# Altium project LoRaBugBoard.PrjPcb
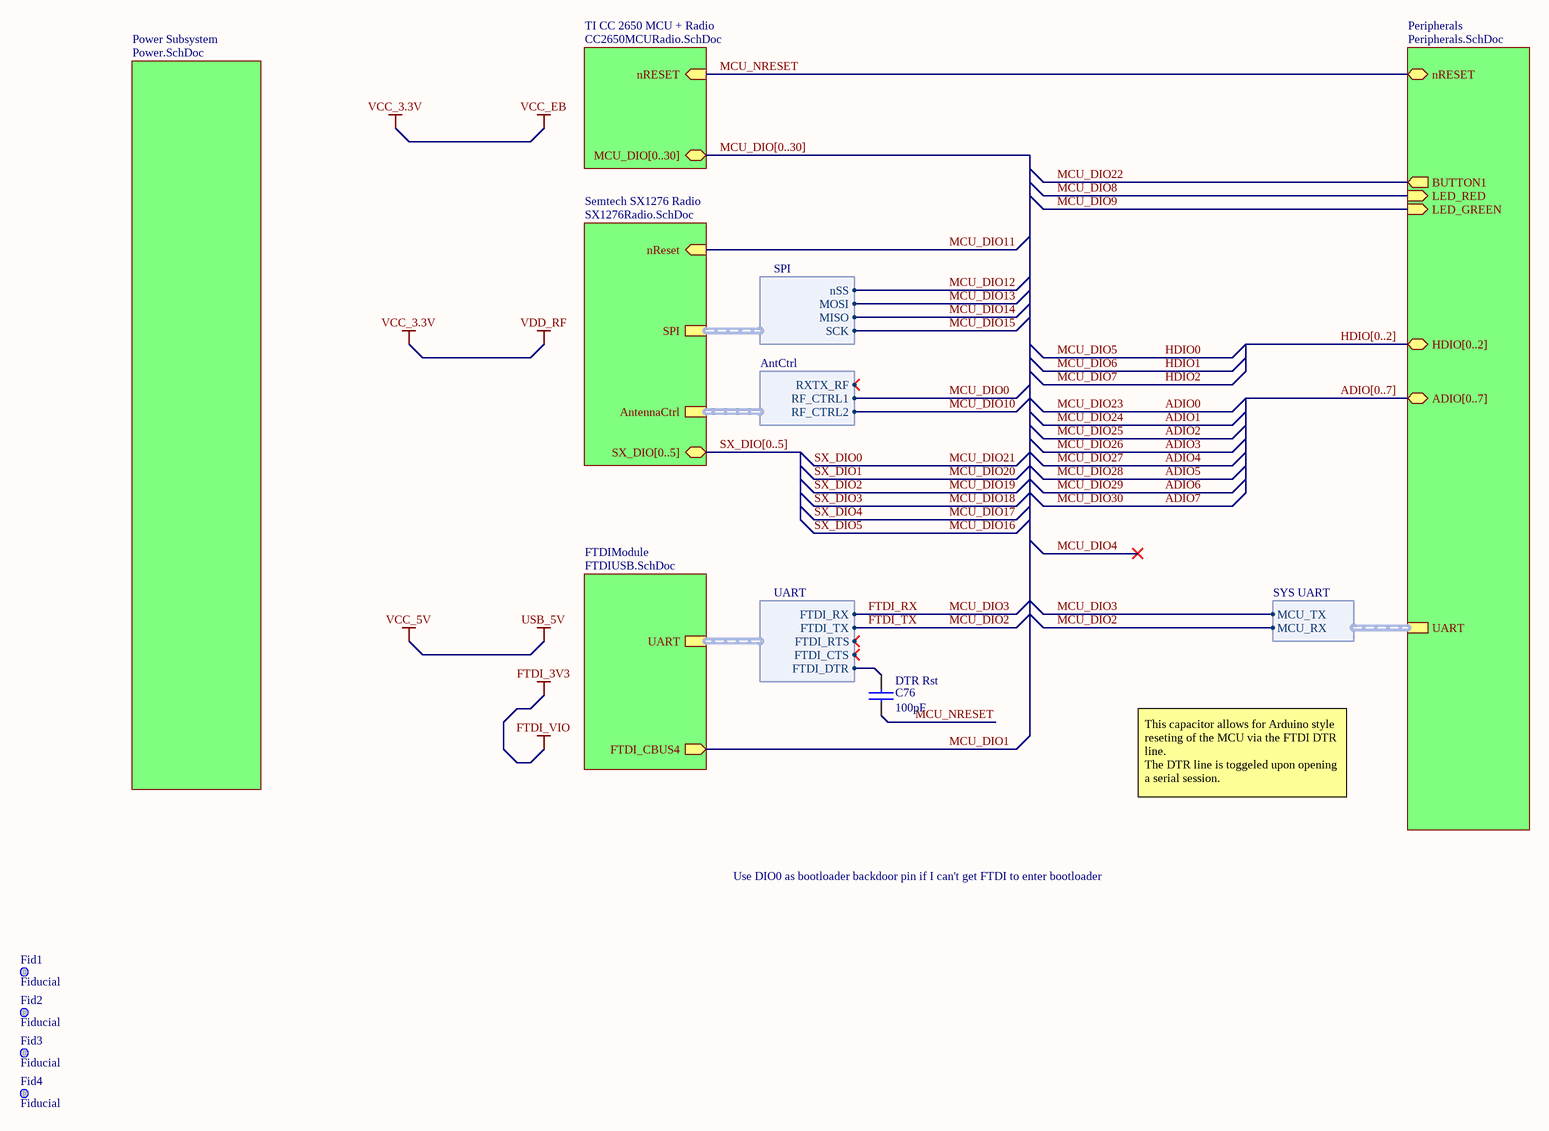
[diagram p0: Main.SchDoc]
6 sheets, 149 parts. Net scope: hierarchical (ports join the sheet entries above them; power ports are global).
Board files: PCBFireflyCase.PcbDoc, PCBFireflyCaseV2.PcbDoc, PCBFireflyCaseV3.PcbDoc, PCBFireflyCaseV3.1.PcbDoc, PCBFireflyCaseV4.PcbDoc
Sheets:
  Main.SchDoc
    Semtech SX1276 Radio = SX1276Radio.SchDoc
    TI CC 2650 MCU + Radio = CC2650MCURadio.SchDoc
    FTDIModule = FTDIUSB.SchDoc
    Peripherals = Peripherals.SchDoc
    Power Subsystem = Power.SchDoc

## Sheet Main.SchDoc: LoRaBug Main
size A3; Author: Craig Hesling; DrawnBy: Craig Hesling; Revision: 3

### Parts
C76  DTR Rst  value 100pF  [CAPC0402(1005)60_N]
Fid1  Fiducial  [Fiducial]
Fid2  Fiducial  [Fiducial]
Fid3  Fiducial  [Fiducial]
Fid4  Fiducial  [Fiducial]

### Sub-sheets
FTDIModule = FTDIUSB.SchDoc: UART (harness UART), FTDI_CBUS4 (out)
Peripherals = Peripherals.SchDoc: BUTTON1 (out), LED_RED (in), LED_GREEN (in), nRESET (bidir), ADIO[0..7] (bidir), HDIO[0..2] (bidir), UART (harness SYS UART)
Power Subsystem = Power.SchDoc: no entries
Semtech SX1276 Radio = SX1276Radio.SchDoc: SPI (harness SPI), nReset (in), AntennaCtrl (harness AntCtrl), SX_DIO[0..5] (bidir)
TI CC 2650 MCU + Radio = CC2650MCURadio.SchDoc: MCU_DIO[0..30] (bidir), nRESET (in)

### Harnesses
UART: FTDI_RX, FTDI_TX, FTDI_CTS, FTDI_RTS, FTDI_DTR
SPI: SCK, nSS, MOSI, MISO
AntCtrl: RF_CTRL1, RF_CTRL2, RXTX_RF
SYS UART: MCU_TX, MCU_RX

### Nets
FTDI_DTR: C76.2 ; sheet FTDIModule/UART.FTDI_DTR
FTDI_RX: sheet FTDIModule/UART.FTDI_RX, sheet Peripherals/UART.MCU_TX  [also labelled MCU_DIO3]  [project net DIO3]
FTDI_TX: sheet FTDIModule/UART.FTDI_TX, sheet Peripherals/UART.MCU_RX  [also labelled MCU_DIO2]  [project net DIO2]
MCU_NRESET: C76.1 ; sheet TI CC 2650 MCU + Radio/nRESET, sheet Peripherals/nRESET

### Buses and harness runs
bus ADIO[0..7] = sheet Peripherals/ADIO[0..7]
bus HDIO[0..2] = sheet Peripherals/HDIO[0..2]
bus MCU_DIO[0..30] = sheet TI CC 2650 MCU + Radio/MCU_DIO[0..30]
bus SX_DIO[0..5] = sheet Semtech SX1276 Radio/SX_DIO[0..5]

### Notes on the sheet
- This capacitor allows for Arduino style reseting of the MCU via the FTDI DTR line.
  The DTR line is toggeled upon opening a serial session.
- Use DIO0 as bootloader backdoor pin if I can't get FTDI to enter bootloader

### Library data of the parts
C76 = CAPACITOR
Fid1-Fid4 = Fiducial: Fiducial mark from Patrick's library

## Sheet SX1276Radio.SchDoc: Semtech SX1276 Radio
size A3; Author: Craig Hesling; DrawnBy: Craig Hesling; Revision: 3.1
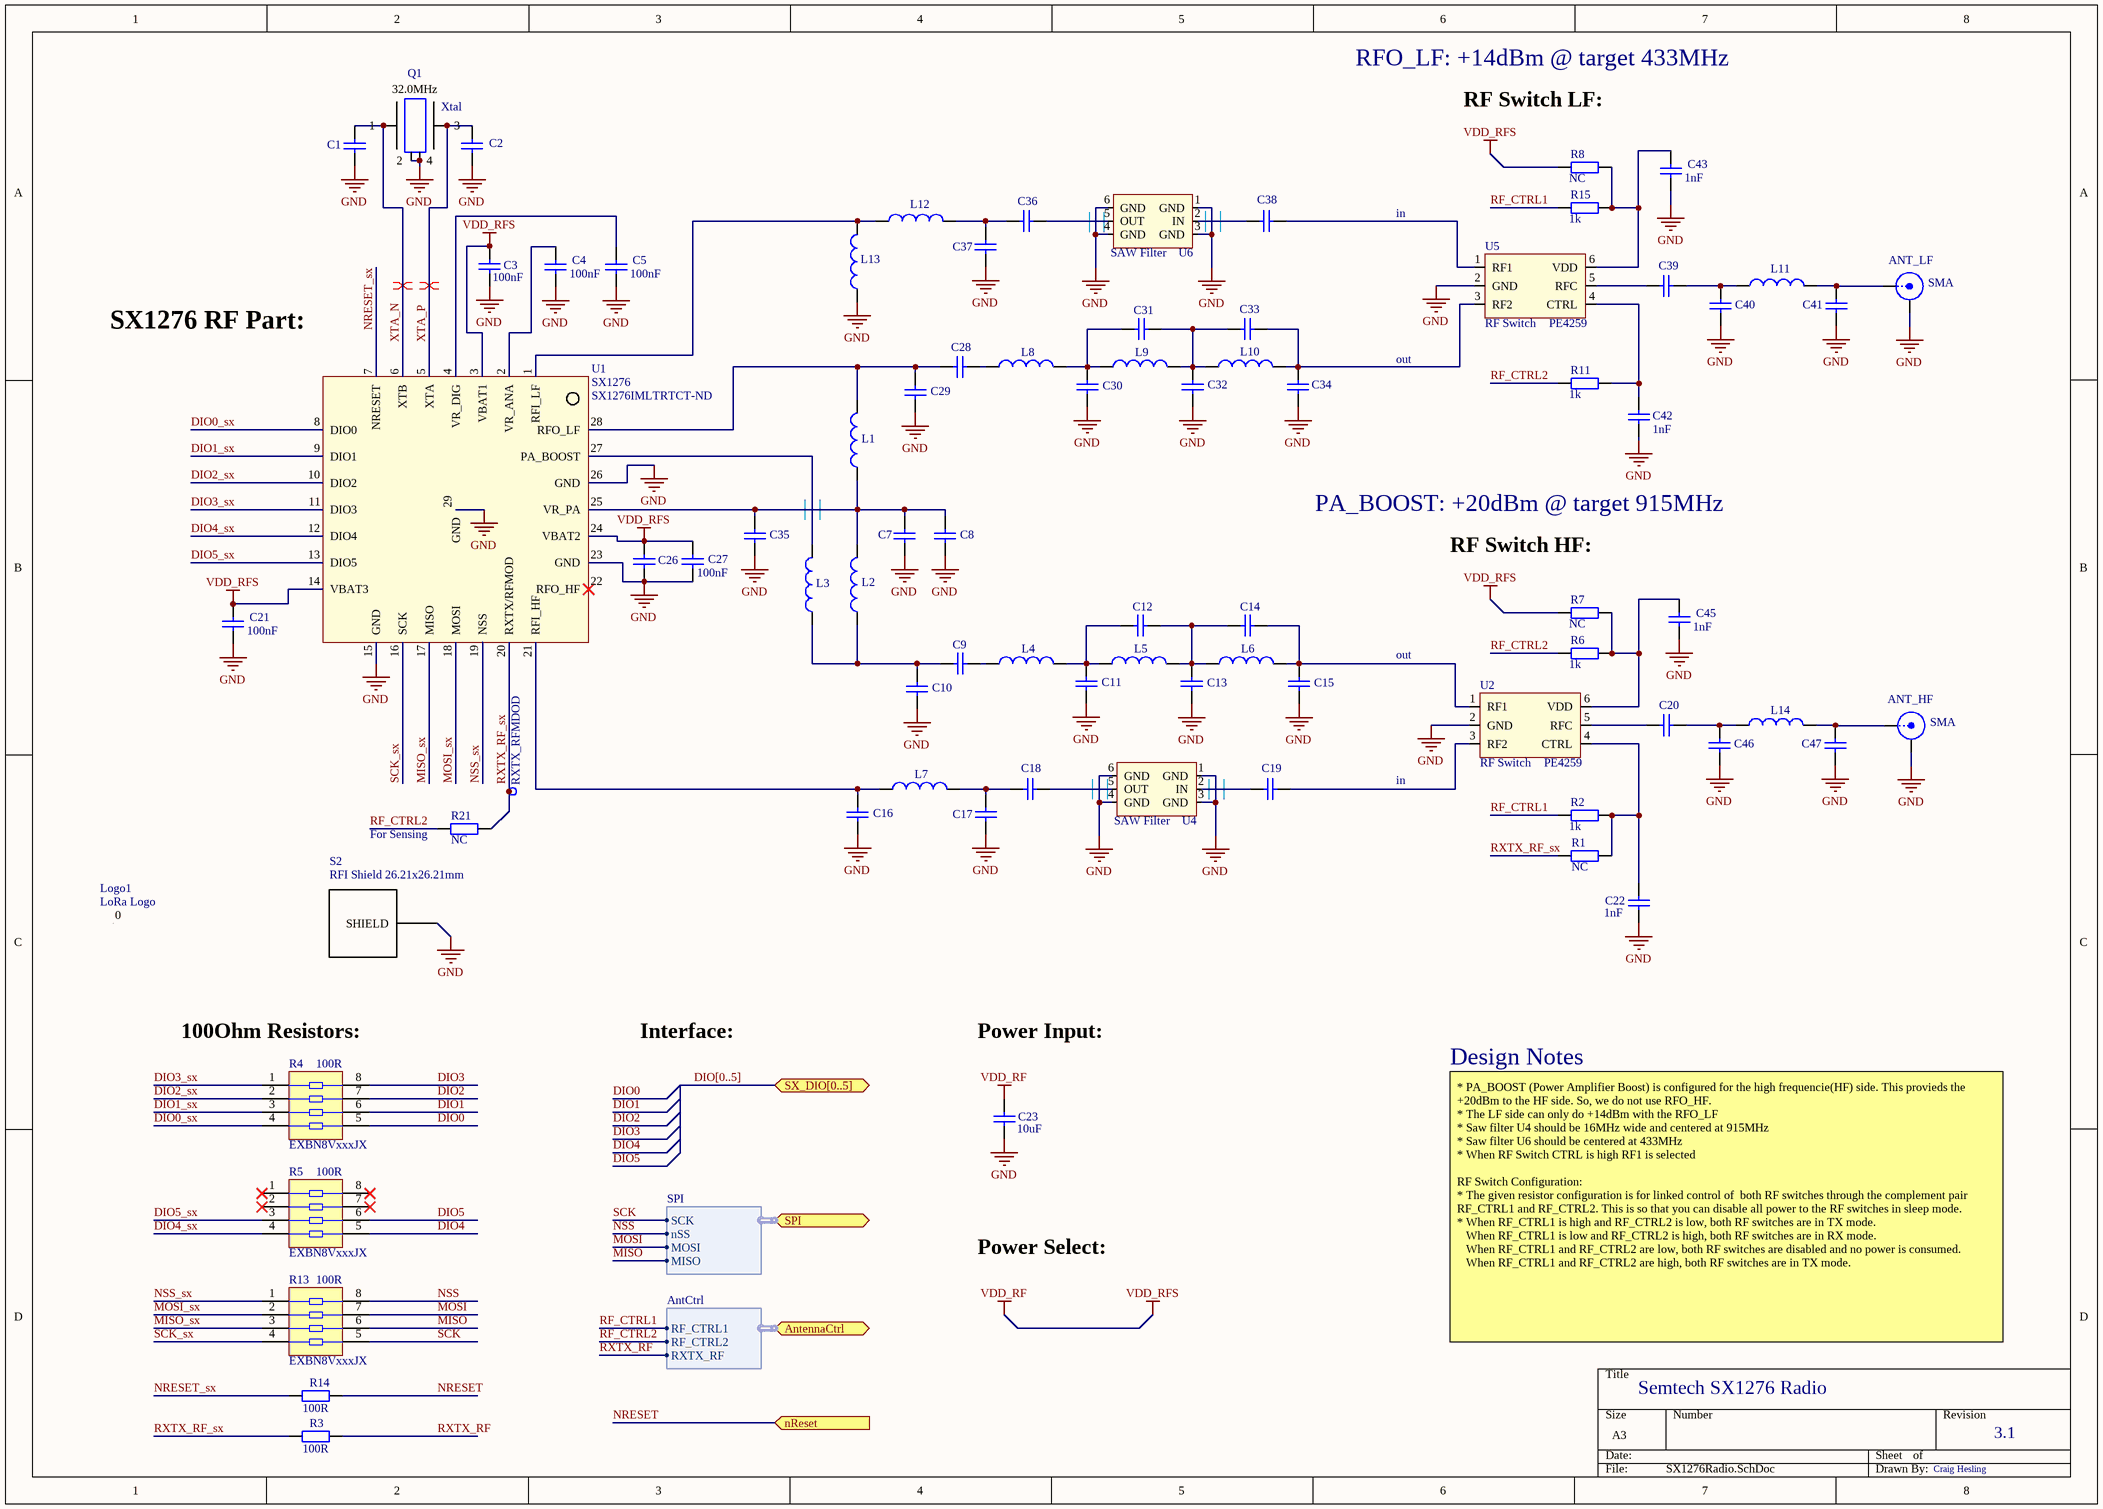
[diagram p1: SX1276Radio.SchDoc]

### Parts
ANT_HF  SMA  [SMA END LAUNCH JACK RECEPTACLE SHORT]
ANT_LF  SMA  [SMA END LAUNCH JACK RECEPTACLE SHORT]
C1  Cap  [rlc_402_smd]  (value not drawn)
C2  Cap  [rlc_402_smd]  (value not drawn)
C3  value 100nF  [rlc_402_smd]  (hidden comment: Cap)
C4  value 100nF  [rlc_402_smd]  (hidden comment: Cap)
C5  value 100nF  [rlc_402_smd]  (hidden comment: Cap)
C7  Cap  [rlc_402_smd]  (value not drawn)
C8  Cap  [rlc_402_smd]  (value not drawn)
C9  Cap  [rlc_402_smd]  (value not drawn)
C10  Cap  [rlc_402_smd]  (value not drawn)
C11  Cap  [rlc_402_smd]  (value not drawn)
C12  Cap  [rlc_402_smd]  (value not drawn)
C13  Cap  [rlc_402_smd]  (value not drawn)
C14  Cap  [rlc_402_smd]  (value not drawn)
C15  Cap  [rlc_402_smd]  (value not drawn)
C16  Cap  [rlc_402_smd]  (value not drawn)
C17  Cap  [rlc_402_smd]  (value not drawn)
C18  Cap  [rlc_402_smd]  (value not drawn)
C19  Cap  [rlc_402_smd]  (value not drawn)
C20  Cap  [rlc_402_smd]  (value not drawn)
C21  value 100nF  [rlc_402_smd]  (hidden comment: Cap)
C22  value 1nF  [rlc_402_smd]  (hidden comment: Cap)
C23  value 10uF  [rlc_805_smd]  (hidden comment: Cap)
C26  Cap  [rlc_402_smd]  (value not drawn)
C27  value 100nF  [rlc_402_smd]  (hidden comment: Cap)
C28  Cap  [rlc_402_smd]  (value not drawn)
C29  Cap  [rlc_402_smd]  (value not drawn)
C30  Cap  [rlc_402_smd]  (value not drawn)
C31  Cap  [rlc_402_smd]  (value not drawn)
C32  Cap  [rlc_402_smd]  (value not drawn)
C33  Cap  [rlc_402_smd]  (value not drawn)
C34  Cap  [rlc_402_smd]  (value not drawn)
C35  Cap  [rlc_402_smd]  (value not drawn)
C36  Cap  [rlc_402_smd]  (value not drawn)
C37  Cap  [rlc_402_smd]  (value not drawn)
C38  Cap  [rlc_402_smd]  (value not drawn)
C39  Cap  [rlc_402_smd]  (value not drawn)
C40  Cap  [rlc_402_smd]  (value not drawn)
C41  Cap  [rlc_402_smd]  (value not drawn)
C42  value 1nF  [rlc_402_smd]  (hidden comment: Cap)
C43  value 1nF  [rlc_402_smd]  (hidden comment: Cap)
C45  value 1nF  [rlc_402_smd]  (hidden comment: Cap)
C46  Cap  [rlc_402_smd]  (value not drawn)
C47  Cap  [rlc_402_smd]  (value not drawn)
L1  Inductor  [rlc_402_smd]  (value not drawn)
L2  Inductor  [rlc_402_smd]  (value not drawn)
L3  Inductor  [rlc_402_smd]  (value not drawn)
L4  Inductor  [rlc_402_smd]  (value not drawn)
L5  Inductor  [rlc_402_smd]  (value not drawn)
L6  Inductor  [rlc_402_smd]  (value not drawn)
L7  Inductor  [rlc_402_smd]  (value not drawn)
L8  Inductor  [rlc_402_smd]  (value not drawn)
L9  Inductor  [rlc_402_smd]  (value not drawn)
L10  Inductor  [rlc_402_smd]  (value not drawn)
L11  Inductor  [rlc_402_smd]  (value not drawn)
L12  Inductor  [rlc_402_smd]  (value not drawn)
L13  Inductor  [rlc_402_smd]  (value not drawn)
L14  Inductor  [rlc_402_smd]  (value not drawn)
Logo1  LoRa Logo  [Logo LoRa Size1]
Q1  Xtal  value 32.0MHz  [nd3225da - nd2520da]
R1  value NC  [rlc_402_smd]  (hidden comment: Resistor)
R2  value 1k  [rlc_402_smd]  (hidden comment: Resistor)
R3  value 100R  [rlc_402_smd]  (hidden comment: Resistor)
R4  EXBN8VxxxJX  value 100R  [EXB28V]
R5  EXBN8VxxxJX  value 100R  [EXB28V]
R6  value 1k  [rlc_402_smd]  (hidden comment: Resistor)
R7  value NC  [rlc_402_smd]  (hidden comment: Resistor)
R8  value NC  [rlc_402_smd]  (hidden comment: Resistor)
R11  value 1k  [rlc_402_smd]  (hidden comment: Resistor)
R13  EXBN8VxxxJX  value 100R  [EXB28V]
R14  value 100R  [rlc_402_smd]  (hidden comment: Resistor)
R15  value 1k  [rlc_402_smd]  (hidden comment: Resistor)
R21  value NC  [rlc_402_smd]  (hidden comment: Resistor)
RXTX_RFMDOD  Test Pin  [pin_SMD]  (value not drawn)
S2  RFI Shield 26.21x26.21mm  [RFI_SHIELD_26.21x26.21MM_Padded]
U1  SX1276  Supplier Part Number 1: SX1276IMLTRTCT-ND  [vqfn28_6x6mm_big_vias]
U2  RF Switch  value PE4259  [SC70-6]
U4  SAW Filter  [DCC6C_3.0x3.0mm]
U5  RF Switch  value PE4259  [SC70-6]
U6  SAW Filter  [DCC6C_3.0x3.0mm]

### Ports
AntennaCtrl (harness AntCtrl), nReset (in), SPI (harness SPI), SX_DIO[0..5] (bidir)

### Harnesses
SPI: SCK, nSS, MOSI, MISO
AntCtrl: RF_CTRL1, RF_CTRL2, RXTX_RF

### Nets
GND: ANT_HF.2(GND) ANT_LF.2(GND) C1.1 C2.1 C3.1 C4.1 C5.1 C7.1 C8.1 C10.1 C11.1 C13.1 C15.1 C16.1 C17.1 C21.1 C22.2 C23.1 C26.1 C27.1 C29.1 C30.1 C32.1 C34.1 C35.1 C37.1 C40.1 C41.1 C42.2 C43.1 C45.1 C46.1 C47.1 L13.1 Q1.2 Q1.4 S2.SHIELD U1.15(GND) U1.23(GND) U1.26(GND) U1.29(GND) U2.2(GND) U4.1(GND) U4.3(GND) U4.4(GND) U4.6(GND) U5.2(GND) U6.1(GND) U6.3(GND) U6.4(GND) U6.6(GND)
VDD_RF: C3.2 C21.2 C23.2 C26.2 C27.2 R7.2 R8.2 U1.3(VBAT1) U1.14(VBAT3) U1.24(VBAT2)  [also labelled VDD_RFS]  [project net VCC_3.3V]
DIO0: R4.5
DIO0_sx: R4.4 U1.8(DIO0)
DIO1: R4.6
DIO1_sx: R4.3 U1.9(DIO1)
DIO2: R4.7  [project net DIO19]
DIO2_sx: R4.2 U1.10(DIO2)
DIO3: R4.8  [project net DIO18]
DIO3_sx: R4.1 U1.11(DIO3)
DIO4: R5.5  [project net DIO17]
DIO4_sx: R5.4 U1.12(DIO4)
DIO5: R5.6  [project net DIO16]
DIO5_sx: R5.3 U1.13(DIO5)
MISO: R13.6 ; port SPI.MISO  [project net DIO14]
MISO_sx: R13.3 U1.17(MISO)
MOSI: R13.7 ; port SPI.MOSI  [project net DIO13]
MOSI_sx: R13.2 U1.18(MOSI)
NRESET: R14.2 ; port nReset  [project net DIO11]
NRESET_sx: R14.1 U1.7(NRESET)
NSS: R13.8 ; port SPI.nSS  [project net DIO12]
NSS_sx: R13.1 U1.19(NSS)
RF_CTRL1: R2.2 R15.2 ; port AntennaCtrl.RF_CTRL1  [project net DIO0]
RF_CTRL2: R6.2 R11.2 R21.2 ; port AntennaCtrl.RF_CTRL2  [project net DIO10]
RXTX_RF: R3.2 ; port AntennaCtrl.RXTX_RF
RXTX_RF_sx: R1.1 R3.1 R21.1 RXTX_RFMDOD.1(pin) U1.20(RXTX/RFMOD)
SCK: R13.5 ; port SPI.SCK  [project net DIO15]
SCK_sx: R13.4 U1.16(SCK)
XTA_N: C1.2 Q1.1 U1.6(XTB)
XTA_P: C2.2 Q1.3 U1.5(XTA)
NetANT_HF_1: ANT_HF.1(Signal) C47.2 L14.2
NetANT_LF_1: ANT_LF.1(Signal) C41.2 L11.2
NetC4_2: C4.2 U1.2(VR_ANA)
NetC5_2: C5.2 U1.4(VR_DIG)
NetC7_2: C7.2 C8.2 C35.2 L1.1 L2.2 U1.25(VR_PA)
NetC9_1: C9.1 L4.1
NetC9_2: C9.2 C10.2 L2.1 L3.1
NetC11_2: C11.2 C12.2 L4.2 L5.1
NetC12_1: C12.1 C13.2 C14.2 L5.2 L6.1
NetC14_1: C14.1 C15.2 L6.2 U2.1(RF1)
NetC16_2: C16.2 L7.1 U1.21(RFI_HF)
NetC17_2: C17.2 C18.2 L7.2
NetC18_1: C18.1 U4.5(OUT)
NetC19_1: C19.1 U2.3(RF2)
NetC19_2: C19.2 U4.2(IN)
NetC20_1: C20.1 C46.2 L14.1
NetC20_2: C20.2 U2.5(RFC)
NetC22_1: C22.1 R1.2 R2.1 U2.4(CTRL)
NetC28_1: C28.1 L8.1
NetC28_2: C28.2 C29.2 L1.2 U1.28(RFO_LF)
NetC30_2: C30.2 C31.2 L8.2 L9.1
NetC31_1: C31.1 C32.2 C33.2 L9.2 L10.1
NetC33_1: C33.1 C34.2 L10.2 U5.3(RF2)
NetC36_1: C36.1 U6.5(OUT)
NetC36_2: C36.2 C37.2 L12.2
NetC38_1: C38.1 U5.1(RF1)
NetC38_2: C38.2 U6.2(IN)
NetC39_1: C39.1 C40.2 L11.1
NetC39_2: C39.2 U5.5(RFC)
NetC42_1: C42.1 R11.1 U5.4(CTRL)
NetC43_2: C43.2 R8.1 R15.1 U5.6(VDD)
NetC45_2: C45.2 R6.1 R7.1 U2.6(VDD)
NetL3_2: L3.2 U1.27(PA_BOOST)
NetL12_1: L12.1 L13.2 U1.1(RFI_LF)

Not connected (* = marked no-connect by the designer): Logo1 0; R5 1* 2* 7* 8*; U1 22(RFO_HF)*

### Buses and harness runs
bus DIO[0..5] = port SX_DIO[0..5]

### Layout directives
differential pair: XTA_N, XTA_P

### Notes on the sheet
- RFO_LF: +14dBm @ target 433MHz
- RF Switch LF:
- in
- (near U1) SX1276 RF Part:
- out
- PA_BOOST: +20dBm @ target 915MHz
- RF Switch HF:
- (near R21) For Sensing
- (near R4) 100Ohm Resistors:
- Interface:
- Power Input:
- Design Notes
- Power Select:
- * PA_BOOST (Power Amplifier Boost) is configured for the high frequencie(HF) side. This provieds the +20dBm to the HF side. So, we do not use RFO_HF.
  * The LF side can only do +14dBm with the RFO_LF
  * Saw filter U4 should be 16MHz wide and centered at 915MHz
  * Saw filter U6 should be centered at 433MHz
  * When RF Switch CTRL is high RF1 is selected
  RF Switch Configuration:
  * The given resistor configuration is for linked control of  both RF switches through the complement pair RF_CTRL1 and RF_CTRL2. This is so that you can disable all power to the RF switches in sleep mode.
  * When RF_CTRL1 is high and RF_CTRL2 is low, both RF switches are in TX mode.
  When RF_CTRL1 is low and RF_CTRL2 is high, both RF switches are in RX mode.
  When RF_CTRL1 and RF_CTRL2 are low, both RF switches are disabled and no power is consumed.
  When RF_CTRL1 and RF_CTRL2 are high, both RF switches are in TX mode.

### Library data of the parts
ANT_HF ANT_LF = SMA: SMA Straight Connector; LatestRevisionDate: 05-oct-2007  -  Semtech; LatestRevisionNote: Re-released for DXP Platform.; Publisher: Altium Limited
C1 = Cap: Capacitor SMD; Value: 18pnF; Published: 8-Jun-2000; LatestRevisionDate: 05-oct-2007  -  Semtech; LatestRevisionNote: Re-released for DXP Platform.; Publisher: Altium Limited
C2 = Cap: Capacitor SMD; Value: 18pF; Published: 8-Jun-2000; LatestRevisionDate: 05-oct-2007  -  Semtech; LatestRevisionNote: Re-released for DXP Platform.; Publisher: Altium Limited
C3-C5 C21-C23 C27 C42 C43 C45 = Cap: Capacitor SMD; Published: 8-Jun-2000; LatestRevisionDate: 05-oct-2007  -  Semtech; LatestRevisionNote: Re-released for DXP Platform.; Publisher: Altium Limited
C7-C20 C28-C33 C35-C39 = Cap: Capacitor SMD; Value: 100nF; Published: 8-Jun-2000; LatestRevisionDate: 05-oct-2007  -  Semtech; LatestRevisionNote: Re-released for DXP Platform.; Publisher: Altium Limited
C26 = Cap: Capacitor SMD; Value: 100pF; Published: 8-Jun-2000; LatestRevisionDate: 05-oct-2007  -  Semtech; LatestRevisionNote: Re-released for DXP Platform.; Publisher: Altium Limited
C34 C40 C41 C46 C47 = Cap: Capacitor SMD; Value: NC; Published: 8-Jun-2000; LatestRevisionDate: 05-oct-2007  -  Semtech; LatestRevisionNote: Re-released for DXP Platform.; Publisher: Altium Limited
L1-L9 L12 L13 = Inductor: Inductor SMD; Code_IEC: 1005; Value: VAL?; Published: 8-Jun-2000; LatestRevisionDate: 05-oct-2007  -  Semtech; LatestRevisionNote: Re-released for DXP Platform.; Publisher: Altium Limited; Code_JEITA: 0402
L10 L11 L14 = Inductor: Inductor SMD; Code_IEC: 1005; Value: 0R; Published: 8-Jun-2000; LatestRevisionDate: 05-oct-2007  -  Semtech; LatestRevisionNote: Re-released for DXP Platform.; Publisher: Altium Limited; Code_JEITA: 0402
Logo1 = Logo: Schematic symbol for Logo
Q1 = Xtal GND: Crystal with GND pins; LatestRevisionDate: 05-oct-2007  -  Semtech
R1-R3 R6-R8 R11 R14 R15 R21 = Resistor: Resistor SMD - IEC symbol version; LatestRevisionDate: 27-Jul-20  -  Semtech
R4 R5 R13 = EXBN8VxxxJX: Mini-Flat Package, Isolated Resistor Network, 0.031 W/resistor; Supplier 1: Digi-Key; Supplier Part Number 1: Y10101TR-ND
RXTX_RFMDOD = test_pin: LatestRevisionDate: 05-oct-2007  -  Semtech
S2 = RFI_SHIELD_26.21x26.21mm: Supplier 1: Digi-Key; Supplier Part Number 1: 903-1008-1-ND
U1 = SX1276: SX1276 - Low Power Integrated UHF Transceiver with loRa Modem; LatestRevisionDate: 27-Jul-2009 -  Semtech; Supplier 1: Digi-Key
U2 U5 = PE4259 RF Switch: PE4259 Peregrine RF Switch; LatestRevisionDate: 03-Sep-2012 -  Semtech
U4 U6 = SAW Filter: SAW Filter - Bandpass - TEMEX type; LatestRevisionDate: 05-oct-2007  -  Semtech

## Sheet CC2650MCURadio.SchDoc: TI CC2650 Radio and MCU
size A3; Author: Craig Hesling; DrawnBy: Craig Hesling; Revision: 2
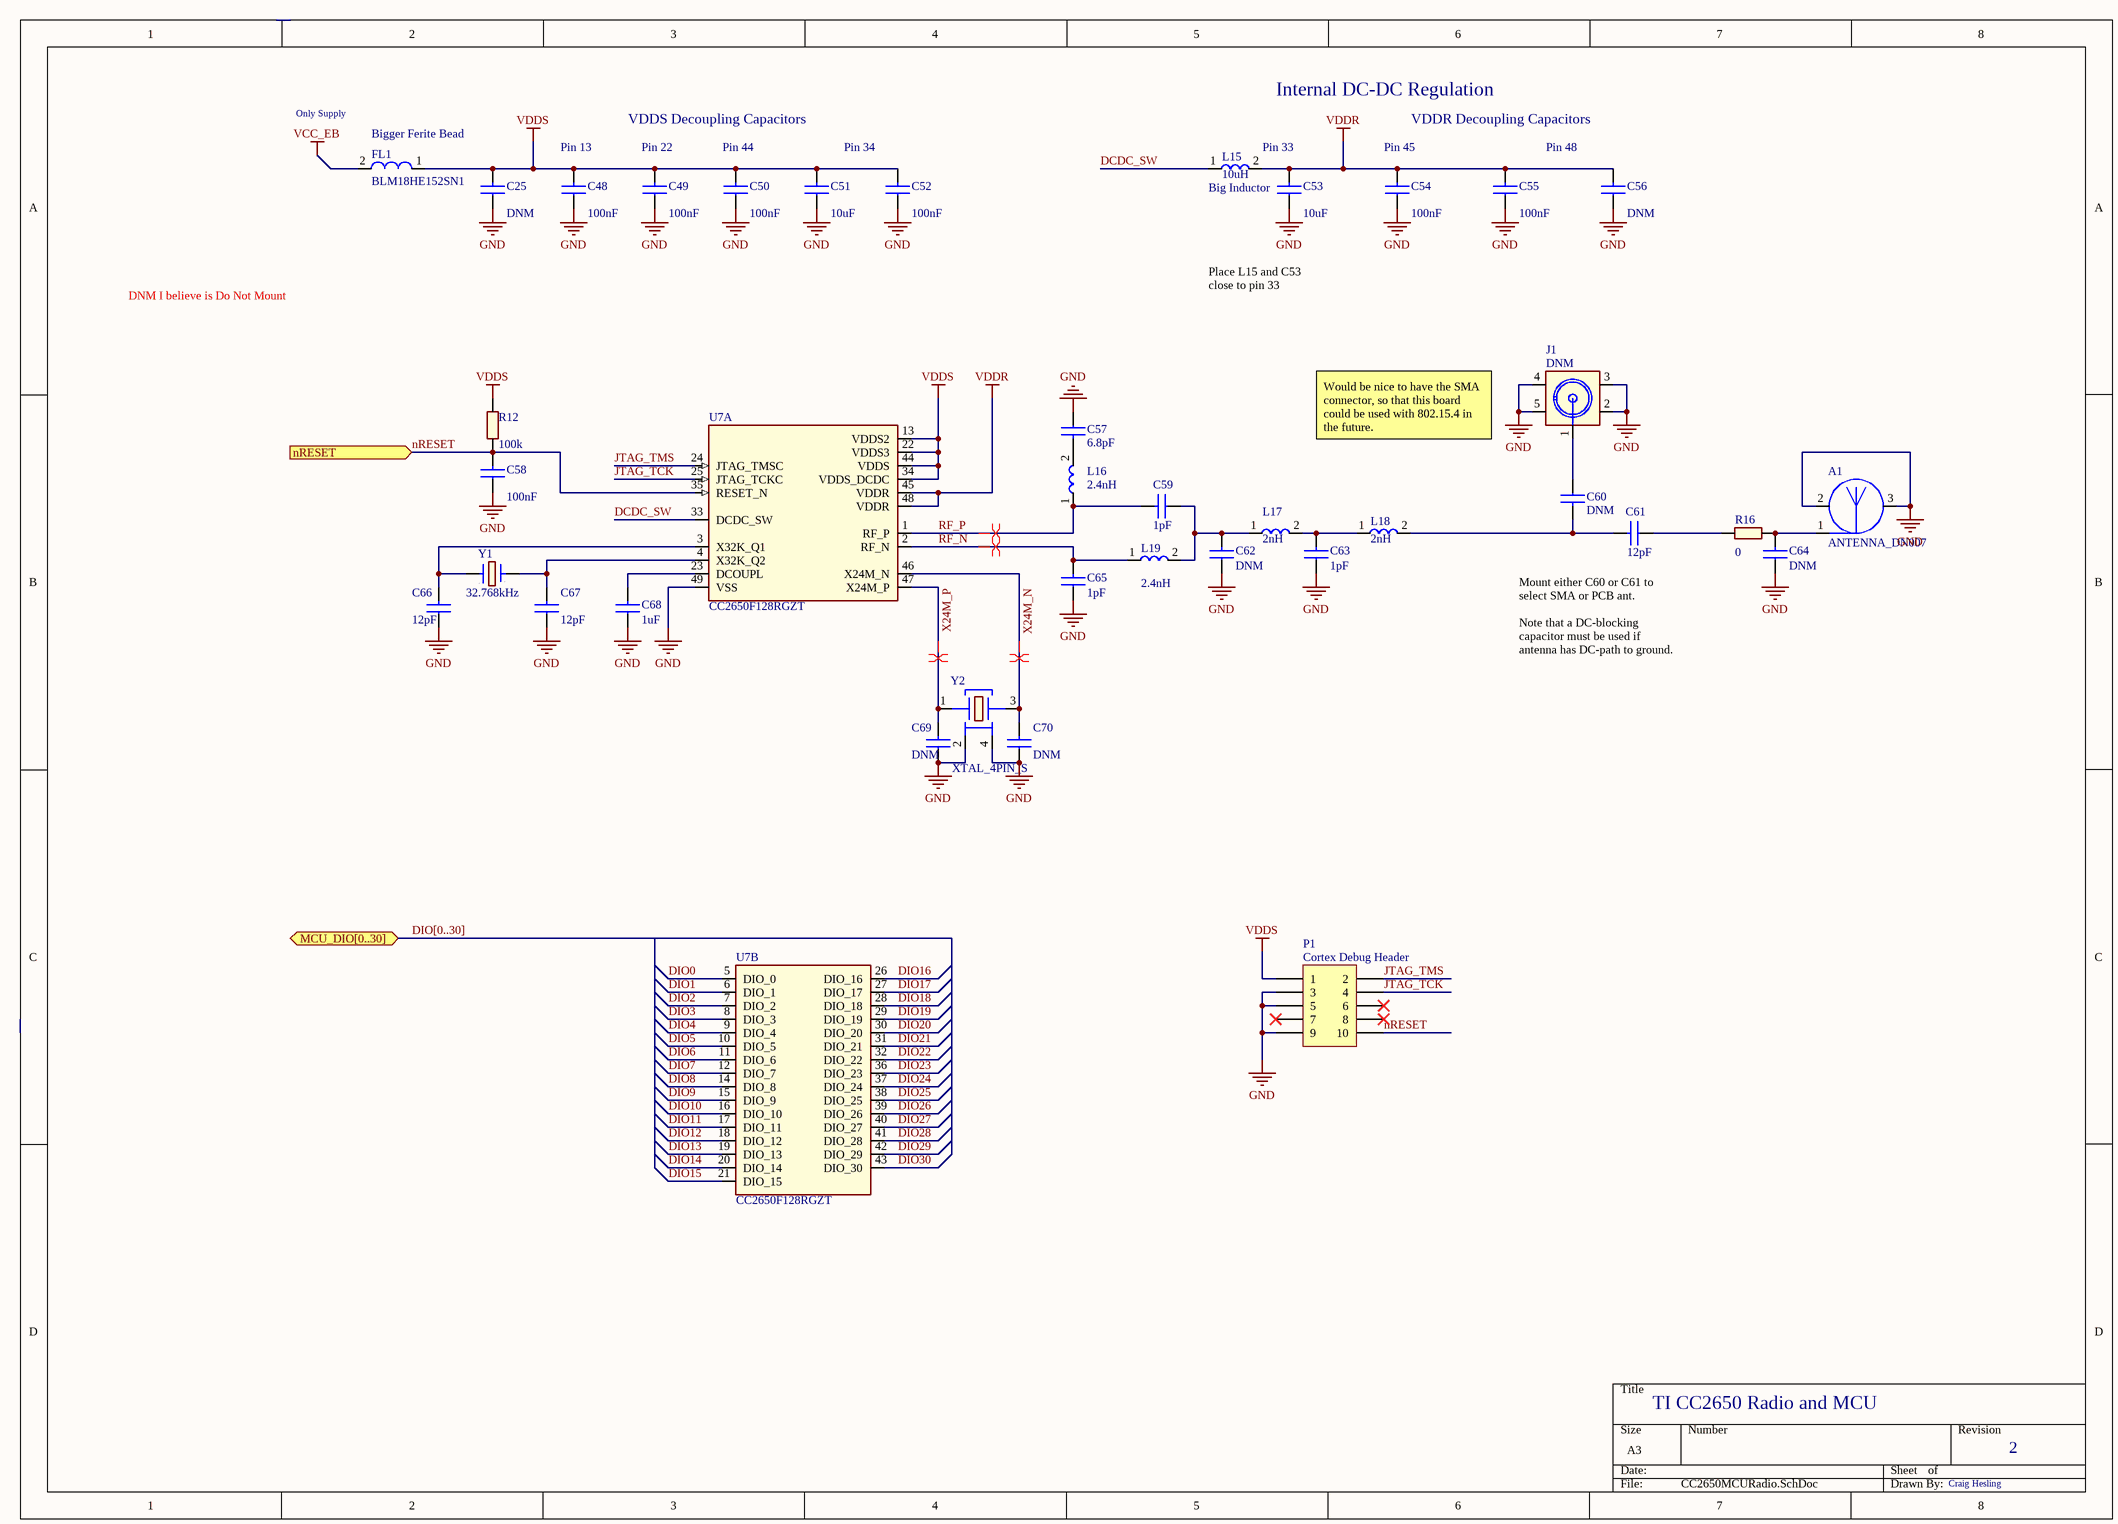
[diagram p2: CC2650MCURadio.SchDoc]

### Parts
A1  ANTENNA_DN007  [ANTENNA_DN007AN_NO_MASK]
C25  value DNM  [CAPC0402(1005)60_N]  (hidden comment: CAPACITOR)
C48  value 100nF  [CAPC0402(1005)60_N]  (hidden comment: CAPACITOR)
C49  value 100nF  [CAPC0402(1005)60_N]  (hidden comment: CAPACITOR)
C50  value 100nF  [CAPC0402(1005)60_N]  (hidden comment: CAPACITOR)
C51  value 10uF  [CAPC0603(1608)100_N]  (hidden comment: CAPACITOR)
C52  value 100nF  [CAPC0603(1608)100_N]  (hidden comment: CAPACITOR)
C53  value 10uF  [CAPC0603(1608)100_N]  (hidden comment: CAPACITOR)
C54  value 100nF  [CAPC0402(1005)60_N]  (hidden comment: CAPACITOR)
C55  value 100nF  [CAPC0402(1005)60_N]  (hidden comment: CAPACITOR)
C56  value DNM  [CAPC0402(1005)60_N]  (hidden comment: CAPACITOR)
C57  value 6.8pF  [CAPC0402(1005)60_N]  (hidden comment: CAPACITOR)
C58  value 100nF  [CAPC0402(1005)60_N]  (hidden comment: CAPACITOR)
C59  value 1pF  [CAPC0402(1005)60_N]  (hidden comment: CAPACITOR)
C60  value DNM  [CAPC0402(1005)60_N]  (hidden comment: CAPACITOR)
C61  value 12pF  [CAPC0402(1005)60_N]  (hidden comment: CAPACITOR)
C62  value DNM  [CAPC0402(1005)60_N]  (hidden comment: CAPACITOR)
C63  value 1pF  [CAPC0402(1005)60_N]  (hidden comment: CAPACITOR)
C64  value DNM  [CAPC0402(1005)60_N]  (hidden comment: CAPACITOR)
C65  value 1pF  [CAPC0402(1005)60_N]  (hidden comment: CAPACITOR)
C66  value 12pF  [CAPC0402(1005)60_N]  (hidden comment: CAPACITOR)
C67  value 12pF  [CAPC0402(1005)60_N]  (hidden comment: CAPACITOR)
C68  value 1uF  [CAPC0402(1005)60_N]  (hidden comment: CAPACITOR)
C69  value DNM  [CAPC0402(1005)60_N]  (hidden comment: CAPACITOR)
C70  value DNM  [CAPC0402(1005)60_N]  (hidden comment: CAPACITOR)
FL1  BLM18HE152SN1  [FIL_BLM18HE152SN1DL]
J1  DNM  [HUSTSAN_SMA10V21TGGAN_POLYGONPOUR_CUTOUT]
L15  value 10uH  [CAPC0805(2012)75_N]  (hidden comment: INDUCTOR)
L16  value 2.4nH  [INDC1005X60L]  (hidden comment: INDUCTOR)
L17  value 2nH  [INDC1005X60L]  (hidden comment: INDUCTOR)
L18  value 2nH  [INDC1005X60L]  (hidden comment: INDUCTOR)
L19  value 2.4nH  [INDC1005X60L]  (hidden comment: INDUCTOR)
P1  Cortex Debug Header  [Header 1.27mm 2x5 SMD]
R12  value 100k  [RESC1005X40L]  (hidden comment: RESISTOR)
R16  value 0  [RESC1005X40L]  (hidden comment: RESISTOR)
U7  CC2650F128RGZT  [QFN50P700X700X100_HS-49N]  (parts A,B of 2)
Y1  Frequency: 32.768kHz  [XTAL_FC-135N]  (hidden comment: CRYSTAL)
Y2  XTAL_4PIN_S  [Crystal 4-SMD 5.0x3.2mm]

### Ports
MCU_DIO[0..30] (bidir), nRESET (in)

### Nets
GND: A1.2(GND_2) A1.3(GND_3) C25.1 C48.1 C49.1 C50.1 C51.1 C52.1 C53.1 C54.1 C55.1 C56.1 C57.1 C58.1 C62.1 C63.1 C64.1 C65.1 C66.1 C67.1 C68.1 C69.1 C70.1 J1.2 J1.3 J1.4 J1.5 P1.3 P1.5 P1.9 U7.49(VSS) Y2.2 Y2.4
VCC_EB: FL1.2  [project net VCC_3.3V]
VDDR: C53.2 C54.2 C55.2 C56.2 L15.2 U7.45(VDDR) U7.48(VDDR)
VDDS: C25.2 C48.2 C49.2 C50.2 C51.2 C52.2 FL1.1 P1.1 R12.2 U7.13(VDDS2) U7.22(VDDS3) U7.34(VDDS_DCDC) U7.44(VDDS)
DCDC_SW: L15.1 U7.33(DCDC_SW)
DIO0: U7.5(DIO_0)
DIO1: U7.6(DIO_1)
DIO2: U7.7(DIO_2)
DIO3: U7.8(DIO_3)
DIO4: U7.9(DIO_4)
DIO5: U7.10(DIO_5)
DIO6: U7.11(DIO_6)
DIO7: U7.12(DIO_7)
DIO8: U7.14(DIO_8)
DIO9: U7.15(DIO_9)
DIO10: U7.16(DIO_10)
DIO11: U7.17(DIO_11)
DIO12: U7.18(DIO_12)
DIO13: U7.19(DIO_13)
DIO14: U7.20(DIO_14)
DIO15: U7.21(DIO_15)
DIO16: U7.26(DIO_16)
DIO17: U7.27(DIO_17)
DIO18: U7.28(DIO_18)
DIO19: U7.29(DIO_19)
DIO20: U7.30(DIO_20)  [project net DIO1]
DIO21: U7.31(DIO_21)  [project net DIO0]
DIO22: U7.32(DIO_22)
DIO23: U7.36(DIO_23)  [project net ADIO0]
DIO24: U7.37(DIO_24)  [project net ADIO1]
DIO25: U7.38(DIO_25)  [project net ADIO2]
DIO26: U7.39(DIO_26)  [project net ADIO3]
DIO27: U7.40(DIO_27)  [project net ADIO4]
DIO28: U7.41(DIO_28)  [project net ADIO5]
DIO29: U7.42(DIO_29)  [project net ADIO6]
DIO30: U7.43(DIO_30)  [project net ADIO7]
JTAG_TCK: P1.4 U7.25(JTAG_TCKC)
JTAG_TMS: P1.2 U7.24(JTAG_TMSC)
nRESET: C58.2 P1.10 R12.1 U7.35(RESET_N) ; port nRESET  [project net MCU_NRESET]
RF_N: C65.2 L19.1 U7.2(RF_N)
RF_P: C59.2 L16.1 U7.1(RF_P)
X24M_N: C70.2 U7.46(X24M_N) Y2.3
X24M_P: C69.2 U7.47(X24M_P) Y2.1
NetA1_1: A1.1(FEED_1) C64.2 R16.1
NetC57_2: C57.2 L16.2
NetC59_1: C59.1 C62.2 L17.1 L19.2
NetC60_1: C60.1 J1.1
NetC60_2: C60.2 C61.2 L18.2
NetC61_1: C61.1 R16.2
NetC63_2: C63.2 L17.2 L18.1
NetC66_2: C66.2 U7.3(X32K_Q1) Y1.1
NetC67_2: C67.2 U7.4(X32K_Q2) Y1.2
NetC68_2: C68.2 U7.23(DCOUPL)

Not connected (* = marked no-connect by the designer): P1 6* 7* 8*

### Buses and harness runs
bus DIO[0..30] = port MCU_DIO[0..30]

### Layout directives
differential pair: RF_N, RF_P, X24M_N, X24M_P

### Notes on the sheet
- (near FL1) Only Supply
- VDDS Decoupling Capacitors
- Internal DC-DC Regulation
- VDDR Decoupling Capacitors
- Bigger Ferite Bead
- (near C48) Pin 13
- (near C49) Pin 22
- (near C50) Pin 44
- Pin 34
- Big Inductor
- Pin 33
- (near C54) Pin 45
- Pin 48
- DNM I believe is Do Not Mount
- Place L15 and C53 close to pin 33
- Would be nice to have the SMA connector, so that this board could be used with 802.15.4 in the future.
- (near C61) Mount either C60 or C61 to select SMA or PCB ant.
  Note that a DC-blocking capacitor must be used if antenna has DC-path to ground.

### Library data of the parts
A1 = ANTENNA_DN007: Designed by: Artur Bielinski; Design date: 2011-09-19
C25 C48-C70 = CAPACITOR: TC2: 0; MAX_TEMP: CTMAX; SLOPE: CSMAX; DIST: FLAT; PSpiceTemplate: C^@REFDES %1 %2 ?TOLERANCE|C^@REFDES| @VALUE ?IC/IC=@IC/ TC=@TC1,@TC2 ?TOLERANCE|\n.model C^@REFDES CAP C=1 DEV=@TOLERANCE%|; KNEE: CBMAX; CURRENT: CIMAX; VOLTAGE: CMAX; TC1: 0
FL1 = FILTER_2PIN
J1 = CONN_COAX_1+4
L15-L19 = INDUCTOR: DIST: FLAT; DIELECTRIC: DSMAX; PSpiceTemplate: L^@REFDES %1 %2 ?TOLERANCE|L^@REFDES| @VALUE ?IC/IC=@IC/ ?TOLERANCE|\n.model l^@REFDES IND L=1 DEV=@TOLERANCE%|; Current: LMAX
P1 = Header 5X2: Header, 5-Pin, Dual row, Right Angle; LatestRevisionDate: 17-Jul-2002; LatestRevisionNote: Re-released for DXP Platform.; Publisher: Altium Limited; Supplier 1: Digi-Key; Supplier 2: Newark; Supplier 3: Allied; Supplier 4: Mouser; Supplier 5: Arrow; Supplier Part Number 1: 609-3695-1-ND; Supplier Part Number 2: 58R3188; Supplier Part Number 3: 70247660; Supplier Part Number 4: 649-202112100010C4LF; Supplier Part Number 5: XRQSqUttyxup-fqyNuPGZKBQalM97QjttTt_8zN-BzU
R12 = RESISTOR: PSpiceTemplate: R^@REFDES %1 %2 ?TOLERANCE|R^@REFDES| @VALUE TC=@TC1,@TC2 ?TOLERANCE|\n.model R^@REFDES RES R=1 DEV=@TOLERANCE%|; VOLTAGE: RVMAX; DIST: FLAT; MAX_TEMP: RTMAX; TC1: 0; POWER: RMAX; TC2: 0
R16 = RESISTOR: PSpiceTemplate: R^@REFDES %1 %2 ?TOLERANCE|R^@REFDES| @VALUE TC=@TC1,@TC2 ?TOLERANCE|\n.model R^@REFDES RES R=1 DEV=@TOLERANCE%|; VOLTAGE: RVMAX; DIST: FLAT; MAX_TEMP: RTMAX; POWER: RMAX; TC1: 0; TC2: 0
U7 = CC2650F128RGZT: Designed_By: Artur Bielinski; SPLIT_INST: TRUE; SWAP_INFO: (S1+S2); Design_Date: 2013-02-14; PartNumber: CC2650F128RGZT; Supplier 1: Mouser; Supplier 2: Newark; Supplier 3: Arrow; Supplier 4: Digi-Key; Supplier Part Number 1: 595-CC2650F128RGZR; Supplier Part Number 2: 51Y5273; Supplier Part Number 3: tP0-S_ikkGau3GntdWAPvj-z4JJMLRcy006RExL3IaQ; Supplier Part Number 4: 296-39656-1-ND

## Sheet FTDIUSB.SchDoc: FTDI USB
size A; Author: Craig Hesling; DrawnBy: Craig Hesling; Revision: 3
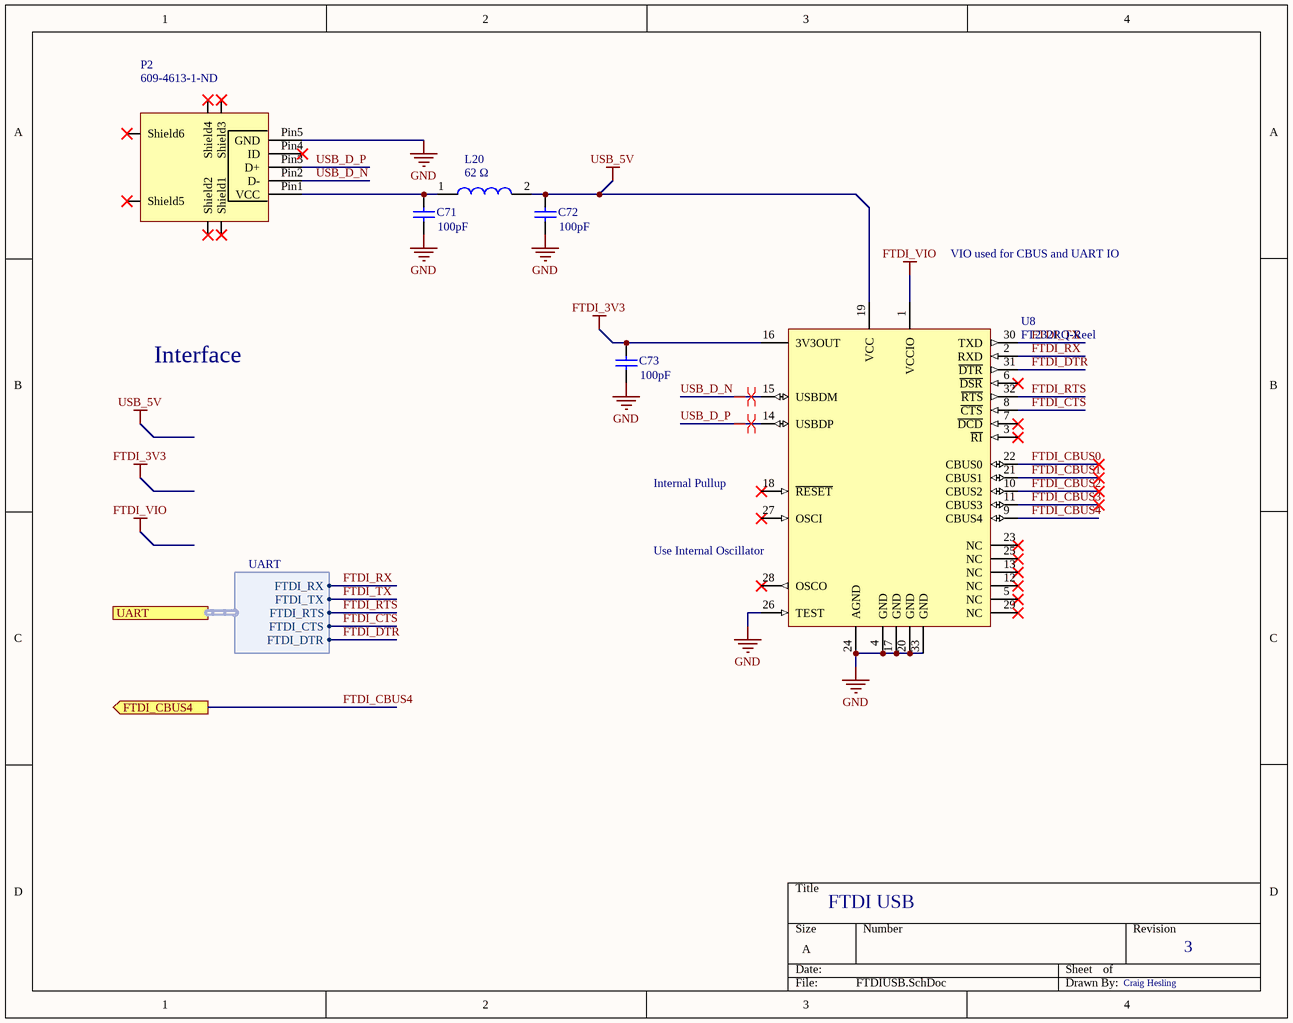
[diagram p3: FTDIUSB.SchDoc]

### Parts
C71  value 100pF  [CAPC0603(1608)100_N]  (hidden comment: Cap Semi)
C72  value 100pF  [CAPC0603(1608)100_N]  (hidden comment: Cap Semi)
C73  value 100pF  [CAPC0603(1608)100_N]  (hidden comment: Cap Semi)
L20  62 Ω  [WE-CBA_0603_HC]
P2  Supplier Part Number 1: 609-4613-1-ND  [MicroUSB_TypeB]  (hidden comment: Micro USB Type-B)
U8  FT232RQ-Reel  [PQFN5X5-32_V_FTDI_BIG_VIAS]

### Ports
FTDI_CBUS4 (out), UART (harness UART)

### Harnesses
UART: FTDI_RX, FTDI_TX, FTDI_DTR, FTDI_CTS, FTDI_RTS

### Nets
FTDI_3V3: C73.2 U8.1(VCCIO) U8.16(3V3OUT)  [also labelled FTDI_VIO]
GND: C71.1 C72.1 C73.1 P2.Pin5(GND) U8.4(GND) U8.17(GND) U8.20(GND) U8.24(AGND) U8.26(TEST) U8.33(GND)
USB_5V: C72.2 L20.2 U8.19(VCC)
FTDI_CBUS0: U8.22(CBUS0)
FTDI_CBUS1: U8.21(CBUS1)
FTDI_CBUS2: U8.10(CBUS2)
FTDI_CBUS3: U8.11(CBUS3)
FTDI_CBUS4: U8.9(CBUS4) ; port FTDI_CBUS4  [project net DIO1]
FTDI_CTS: U8.8(~{CTS}) ; port UART.FTDI_CTS
FTDI_DTR: U8.31(~{DTR}) ; port UART.FTDI_DTR
FTDI_RTS: U8.32(~{RTS}) ; port UART.FTDI_RTS
FTDI_RX: U8.2(RXD) ; port UART.FTDI_RX  [project net DIO3]
FTDI_TX: U8.30(TXD) ; port UART.FTDI_TX  [project net DIO2]
USB_D_N: P2.Pin2(D-) U8.15(USBDM)
USB_D_P: P2.Pin3(D+) U8.14(USBDP)
NetC71_2: C71.2 L20.1 P2.Pin1(VCC)

Not connected (* = marked no-connect by the designer): P2 Pin4(ID)* Shield1* Shield2* Shield3* Shield4* Shield5* Shield6*; U8 3(~{RI})* 5(NC)* 6(~{DSR})* 7(~{DCD})* 12(NC)* 13(NC)* 18(~{RESET})* 23(NC)* 25(NC)* 27(OSCI)* 28(OSCO)* 29(NC)*

### Layout directives
differential pair: USB_D_N, USB_D_P

### Notes on the sheet
- VIO used for CBUS and UART IO
- Interface
- (near U8) Internal Pullup
- (near U8) Use Internal Oscillator

### Library data of the parts
C71-C73 = Cap Semi: Capacitor (Semiconductor SIM Model); Published: 8-Jun-2000; LatestRevisionDate: 29-May-2009; LatestRevisionNote: IPC-7351 Footprint Added.; PackageReference: C1206; Publisher: Altium Limited; PackageDescription: Chip Capacitor
L20 = WE-CBA 0603,  782633620: WE-CBA SMD EMI Suppression Ferrite Bead, Impedance = 62 Ω, High Current; Manufacturer: Wurth Elektronik; partNo: 782633620; Impedance: 62 Ω; ComponentLink1Description: Manufacturer; ComponentLink1URL: http://www.we-online.de; Created by: Baojun Chen; Created Date: Nov.2015; ComponentLink2Description: Datasheet; ComponentLink2URL: http://katalog.we-online.de/pbs/datasheet/782633620.pdf; Supplier 1: Digi-Key; Supplier Part Number 1: 732-6702-1-ND
P2 = MicroUSB TypeB: Micro USB Type B Port; Supplier: http://www.digikey.com/product-detail/en/amphenol-fci/10118192-0001LF/609-4613-2-ND/2785387; Datasheet: http://portal.fciconnect.com/Comergent//fci/drawing/10118192.pdf; Supplier 1: Digi-Key
U8 = FT232RQ-Reel: USB UART Asynchronous Serial Data Transfer Chip, 32-pin QFN, Tape and Reel; Manufacturer: FTDI; DatasheetVersion: ver 2.10, Mar-2012; PackageVersion: Mar-12; PackageReference: PQFN5X5-32; PackageDescription: 32-Pin Quad Flat No-Lead 0.5 mm Pitch, Pullback, 3.2 x 3.2 mm Exposed Pad; PartNumber: FT232RQ-Reel; ComponentLink1Description: Manufacturer URL; ComponentLink1URL: http://www.ftdichip.com/; ComponentLink2Description: Datasheet; ComponentLink2URL: http://www.ftdichip.com/Support/Documents/DataSheets/ICs/DS_FT232R.pdf

## Sheet Peripherals.SchDoc: Peripherals
size A; Author: Craig Hesling; DrawnBy: Craig Hesling; Revision: 2
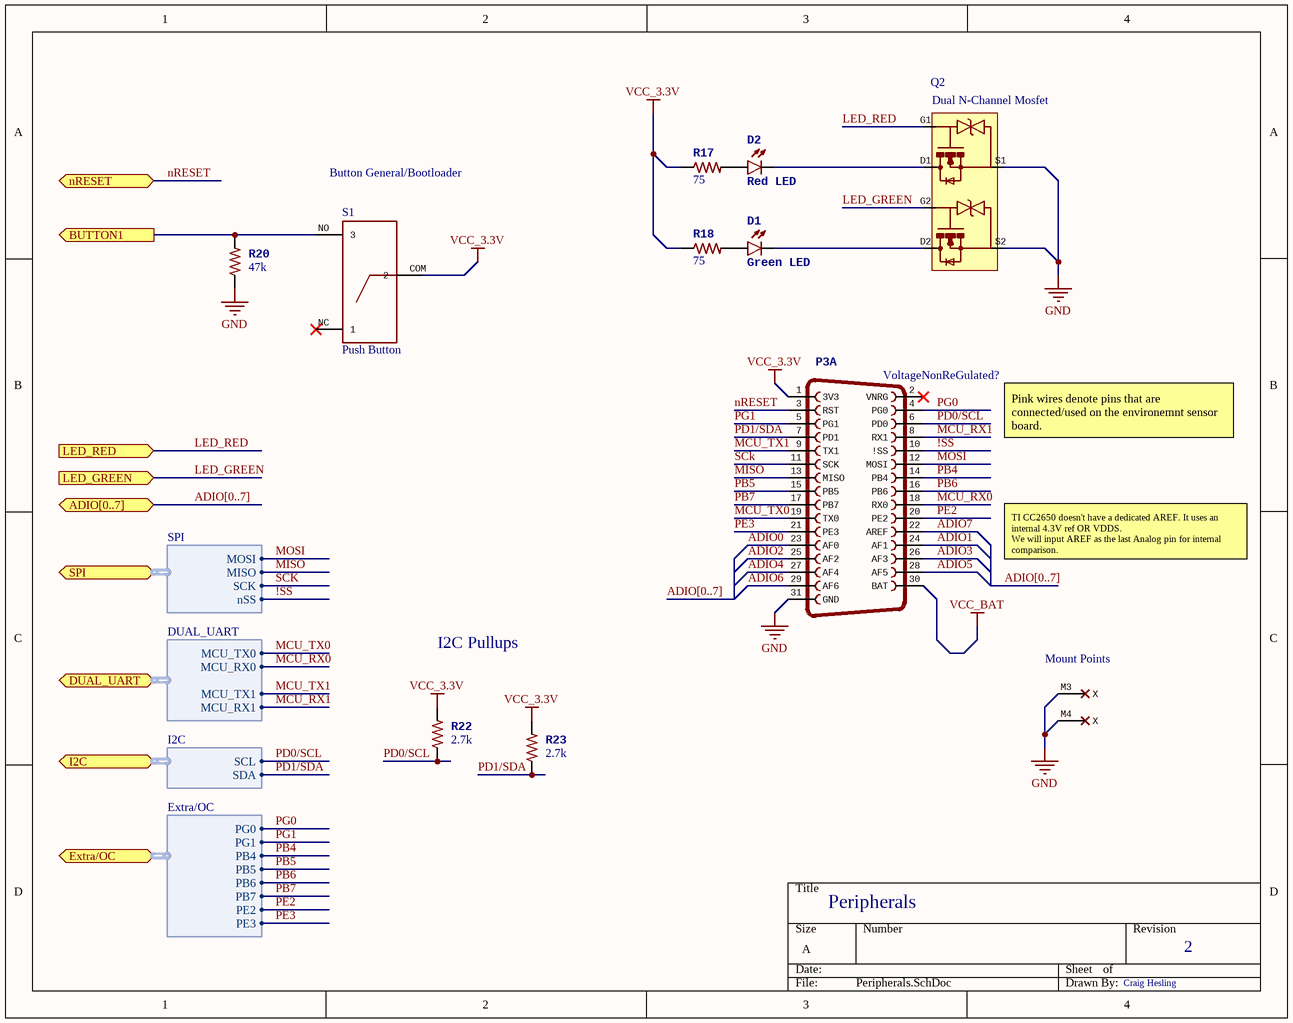
[diagram p4: Peripherals.SchDoc]

### Parts
D1  Green LED  [LED-0603]
D2  Red LED  [LED-0603]
P3  Addon Board for Firefly Sensor Nodes    This version is compliant with Firefly Micro powered by Atmel Atmega128RFA1.    Connectors on female gender match those on Firefly Micro Board.    Connectors on male gender mate with Firefly Micro Board. Use these for addons.  [FIREFLY_MICRO_BOARD]  (value not drawn)  (parts A,B,C of 3)
Q2  Dual N-Channel Mosfet  [FC6946010R (high-density)]
R17  value 75  [0603-RES]  (hidden comment: RES-00818)
R18  value 75  [0603-RES]  (hidden comment: RES-00818)
R20  value 47k  [0603-RES]  (hidden comment: RES-00824)
R22  value 2.7k  [0603-RES]  (hidden comment: RES-00824)
R23  value 2.7k  [0603-RES]  (hidden comment: RES-00824)
S1  Push Button  [Push_Button]

### Ports
ADIO[0..7] (bidir), BUTTON1 (out), DUAL_UART (harness DUAL_UART), Extra/OC (harness Extra/OC), I2C (harness I2C), LED_GREEN (in), LED_RED (in), nRESET (bidir), SPI (harness SPI)

### Harnesses
SPI: MOSI, MISO, SCK, nSS
DUAL_UART: MCU_TX0, MCU_RX0, MCU_TX1, MCU_RX1
I2C: SCL, SDA
Extra/OC: PG0, PG1, PB4, PB6, PB5, PB7, PE2, PE3

### Nets
GND: P3.31(GND) P3.M3(X) P3.M4(X) Q2.S1 Q2.S2 R20.1
VCC_3.3V: P3.1(3V3) P3.30(BAT) R17.1 R18.1 R22.2 R23.2 S1.COM(2)  [also labelled VCC_BAT]
!SS: P3.10(!SS) ; port SPI.nSS
ADIO0: P3.23(AF0)
ADIO1: P3.24(AF1)
ADIO2: P3.25(AF2)
ADIO3: P3.26(AF3)
ADIO4: P3.27(AF4)
ADIO5: P3.28(AF5)
ADIO6: P3.29(AF6)
ADIO7: P3.22(AREF)
DIO22: R20.2 S1.NO(3) ; port BUTTON1
LED_GREEN: Q2.G2 ; port LED_GREEN  [project net DIO9]
LED_RED: Q2.G1 ; port LED_RED  [project net DIO8]
MCU_RX0: P3.18(RX0) ; port DUAL_UART.MCU_RX0
MCU_RX1: P3.8(RX1) ; port DUAL_UART.MCU_RX1
MCU_TX0: P3.19(TX0) ; port DUAL_UART.MCU_TX0
MCU_TX1: P3.9(TX1) ; port DUAL_UART.MCU_TX1
MISO: P3.13(MISO) ; port SPI.MISO
MOSI: P3.12(MOSI) ; port SPI.MOSI
nRESET: P3.3(RST) ; port nRESET  [project net MCU_NRESET]
PB4: P3.14(PB4) ; port Extra/OC.PB4
PB5: P3.15(PB5) ; port Extra/OC.PB5
PB6: P3.16(PB6) ; port Extra/OC.PB6
PB7: P3.17(PB7) ; port Extra/OC.PB7
PD0/SCL: P3.6(PD0) R22.1 ; port I2C.SCL
PD1/SDA: P3.7(PD1) R23.1 ; port I2C.SDA
PE2: P3.20(PE2) ; port Extra/OC.PE2
PE3: P3.21(PE3) ; port Extra/OC.PE3
PG0: P3.4(PG0) ; port Extra/OC.PG0
PG1: P3.5(PG1) ; port Extra/OC.PG1
SCK: P3.11(SCK) ; port SPI.SCK
NetD1_A: D1.A R18.2
NetD1_C: D1.C Q2.D2
NetD2_A: D2.A R17.2
NetD2_C: D2.C Q2.D1

Not connected (* = marked no-connect by the designer): P3 2(VNRG)*; S1 NC(1)*

### Buses and harness runs
bus ADIO[0..7]
bus ADIO[0..7] = port ADIO[0..7]

### Notes on the sheet
- Button General/Bootloader
- (near P3) VoltageNonReGulated?
- Pink wires denote pins that are connected/used on the environemnt sensor board.
- TI CC2650 doesn't have a dedicated AREF. It uses an internal 4.3V ref OR VDDS.
  We will input AREF as the last Analog pin for internal comparison.
- I2C Pullups
- (near P3) Mount Points

### Library data of the parts
D1 = LED-GREEN0603: PROD_ID: DIO-00821
D2 = LED-RED0603: PROD_ID: DIO-00819
P3 = FIREFLY_MICRO_BOARD: GENDER: Female
Q2 = FC6946010R: Panasonic Dual N-Channel Moseft FC6946010R; Supplier 1: Newark; Supplier 2: Digi-Key; Supplier Part Number 1: 63W2173; Supplier Part Number 2: FC6946010RCT-ND
R17 R18 = 330OHM1/10W1%(0603): PROD_ID: RES-00818
R20 R22 R23 = 10KOHM-1/10W-1%(0603)0603: PROD_ID: RES-00824
S1 = CFPA: Supplier 1: Digi-Key; Supplier Part Number 1: 563-1246-2-ND

## Sheet Power.SchDoc: Power
size A; Author: Craig Hesling; DrawnBy: Craig Hesling; Revision: 3
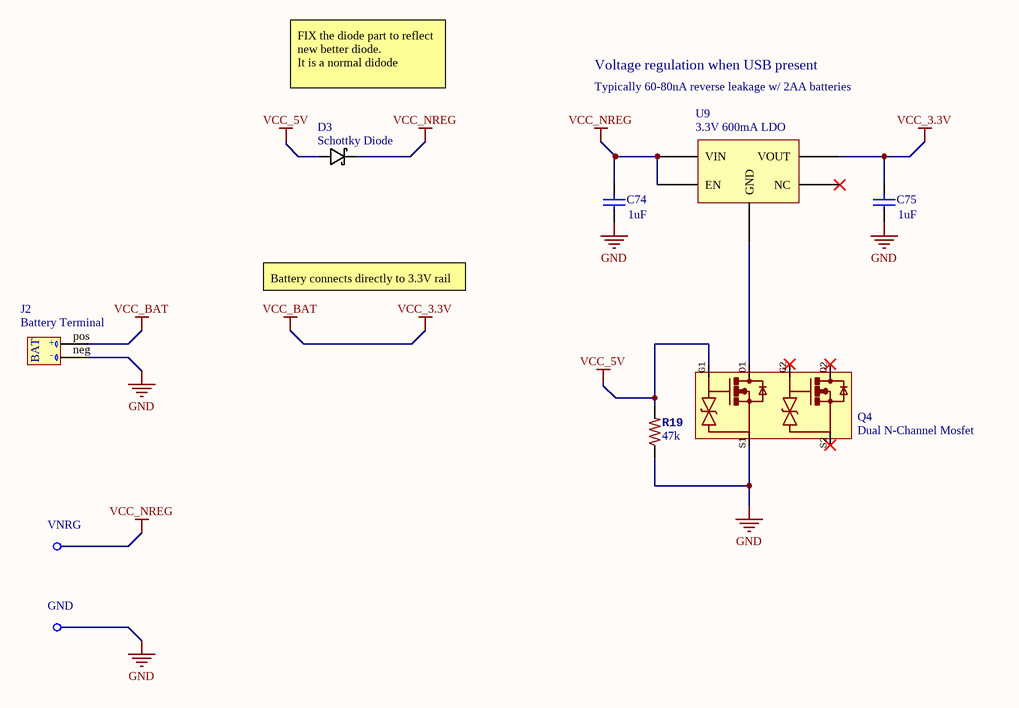
[diagram p5: Power.SchDoc]

### Parts
C74  value 1uF  [1608[0603]]  (hidden comment: Cap Semi)
C75  value 1uF  [1608[0603]]  (hidden comment: Cap Semi)
D3  Schottky Diode  [DB2J20900L (high-density)]
GND  Test Pin  [pin_1mm]  (value not drawn)
J2  Battery Terminal  [Battery Terminal]
Q4  Dual N-Channel Mosfet  [FC6946010R (high-density)]
R19  value 47k  [0603-RES]  (hidden comment: RES-00818)
U9  3.3V 600mA LDO  [AP7365-SOT25 (high-density)]
VNRG  (no value)  [pin_1mm]

### Nets
GND: C74.1 C75.1 GND.1(pin) J2.neg Q4.S1 R19.1
VCC_3.3V: C75.2 J2.pos U9.VOUT  [also labelled VCC_BAT]
VCC_5V: D3.2 Q4.G1 R19.2  [project net USB_5V]
VCC_NREG: C74.2 D3.1 U9.EN U9.VIN VNRG.1(pin)
NetQ4_D1: Q4.D1 U9.GND

Not connected (* = marked no-connect by the designer): Q4 D2* G2* S2*; U9 NC*

### Notes on the sheet
- FIX the diode part to reflect new better diode.
  It is a normal didode
- Voltage regulation when USB present
- Typically 60-80nA reverse leakage w/ 2AA batteries
- Battery connects directly to 3.3V rail
- (in symbol Battery Terminal) +; BAT; -

### Library data of the parts
C74 C75 = Cap Semi: Capacitor (Semiconductor SIM Model); Published: 8-Jun-2000; LatestRevisionDate: 29-May-2009; LatestRevisionNote: IPC-7351 Footprint Added.; PackageReference: C1206; Publisher: Altium Limited; PackageDescription: Chip Capacitor
D3 = DB2J20900L: Schottky Diode BAS 52-02V H6327
GND = test_pin: LatestRevisionDate: 05-oct-2007  -  Semtech
Q4 = FC6946010R: as Q2 on sheet Peripherals; Supplier 1: Newark; Supplier 2: Digi-Key; Supplier Part Number 1: 63W2173; Supplier Part Number 2: FC6946010RCT-ND
R19 = 330OHM1/10W1%(0603): PROD_ID: RES-00818
U9 = AP7365-33WG-7: AP7365-33WG-7 3.9V 600mA LDO; Supplier 1: Digi-Key; Supplier 2: Arrow; Supplier Part Number 1: AP7365-33WG-7DICT-ND; Supplier Part Number 2: 8jDkOUuQMN4bQRMK7daIL_aN6lyR31ZrRHAvlbe4_1s
VNRG = test_pin: Voltage Non-Regulated; LatestRevisionDate: 05-oct-2007  -  Semtech

## Nets that join several sheets
GND: SX1276Radio (51 pins), CC2650MCURadio (33 pins), FTDIUSB (10 pins), Peripherals (6 pins), Power (6 pins)
USB_5V: FTDIUSB (C72.2 L20.2 U8.19), Power (D3.2 Q4.G1 R19.2)
VCC_3.3V: SX1276Radio (10 pins), CC2650MCURadio (FL1.2), Peripherals (7 pins), Power (C75.2 J2.pos U9.VOUT)
ADIO0: CC2650MCURadio (U7.36), Peripherals (P3.23)
ADIO1: CC2650MCURadio (U7.37), Peripherals (P3.24)
ADIO2: CC2650MCURadio (U7.38), Peripherals (P3.25)
ADIO3: CC2650MCURadio (U7.39), Peripherals (P3.26)
ADIO4: CC2650MCURadio (U7.40), Peripherals (P3.27)
ADIO5: CC2650MCURadio (U7.41), Peripherals (P3.28)
ADIO6: CC2650MCURadio (U7.42), Peripherals (P3.29)
ADIO7: CC2650MCURadio (U7.43), Peripherals (P3.22)
DIO0: SX1276Radio (R2.2 R15.2), CC2650MCURadio (U7.5)
DIO0: SX1276Radio (R4.5), CC2650MCURadio (U7.31)
DIO1: SX1276Radio (R4.6), CC2650MCURadio (U7.30)
DIO1: CC2650MCURadio (U7.6), FTDIUSB (U8.9)
DIO2: CC2650MCURadio (U7.7), FTDIUSB (U8.30)
DIO3: CC2650MCURadio (U7.8), FTDIUSB (U8.2)
DIO8: CC2650MCURadio (U7.14), Peripherals (Q2.G1)
DIO9: CC2650MCURadio (U7.15), Peripherals (Q2.G2)
DIO10: SX1276Radio (R6.2 R11.2 R21.2), CC2650MCURadio (U7.16)
DIO11: SX1276Radio (R14.2), CC2650MCURadio (U7.17)
DIO12: SX1276Radio (R13.8), CC2650MCURadio (U7.18)
DIO13: SX1276Radio (R13.7), CC2650MCURadio (U7.19)
DIO14: SX1276Radio (R13.6), CC2650MCURadio (U7.20)
DIO15: SX1276Radio (R13.5), CC2650MCURadio (U7.21)
DIO16: SX1276Radio (R5.6), CC2650MCURadio (U7.26)
DIO17: SX1276Radio (R5.5), CC2650MCURadio (U7.27)
DIO18: SX1276Radio (R4.8), CC2650MCURadio (U7.28)
DIO19: SX1276Radio (R4.7), CC2650MCURadio (U7.29)
DIO22: CC2650MCURadio (U7.32), Peripherals (R20.2 S1.NO)
FTDI_DTR: Main (C76.2), FTDIUSB (U8.31)
MCU_NRESET: Main (C76.1), CC2650MCURadio (C58.2 P1.10 R12.1 U7.35), Peripherals (P3.3)